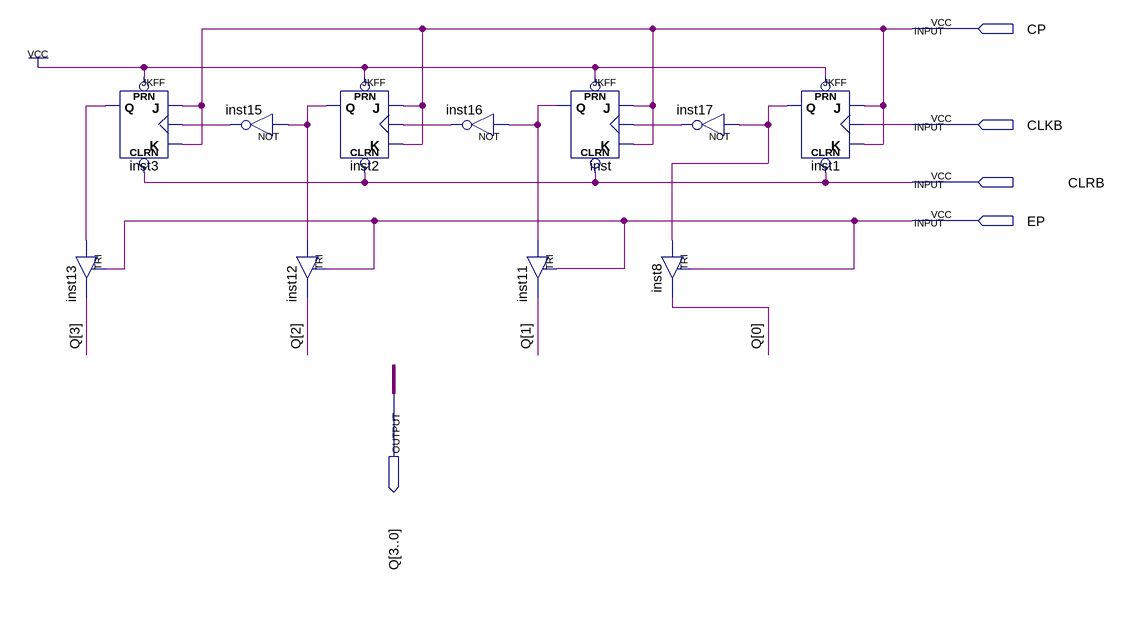
[diagram p0: schematic sheet]
// Quartus schematic Contador_de_Programa.bdf as structural Verilog: 11 symbols, 5 pins
module Contador_de_Programa (
  input  CP,
  input  CLKB,
  input  CLRB,
  input  EP,
  output [3:0] Q
);

  wire inst1_q, inst2_q, inst3_q, inst15_out, inst16_out, inst17_out, inst_q;

  JKFF inst3 (.PRN(1'b1), .CLRN(CLRB), .K(CP), .J(CP), .CLK(inst15_out), .Q(inst3_q));
  TRI inst13 (.IN(inst3_q), .OE(EP), .OUT(Q[3]));
  not inst15 (inst15_out, inst2_q);
  TRI inst12 (.IN(inst2_q), .OE(EP), .OUT(Q[2]));
  JKFF inst2 (.PRN(1'b1), .CLRN(CLRB), .K(CP), .J(CP), .CLK(inst16_out), .Q(inst2_q));
  not inst16 (inst16_out, inst_q);
  TRI inst11 (.IN(inst_q), .OE(EP), .OUT(Q[1]));
  JKFF inst (.PRN(1'b1), .CLRN(CLRB), .K(CP), .J(CP), .CLK(inst17_out), .Q(inst_q));
  TRI inst8 (.IN(inst1_q), .OE(EP), .OUT(Q[0]));
  not inst17 (inst17_out, inst1_q);
  JKFF inst1 (.PRN(1'b1), .CLRN(CLRB), .K(CP), .J(CP), .CLK(CLKB), .Q(inst1_q));
endmodule
